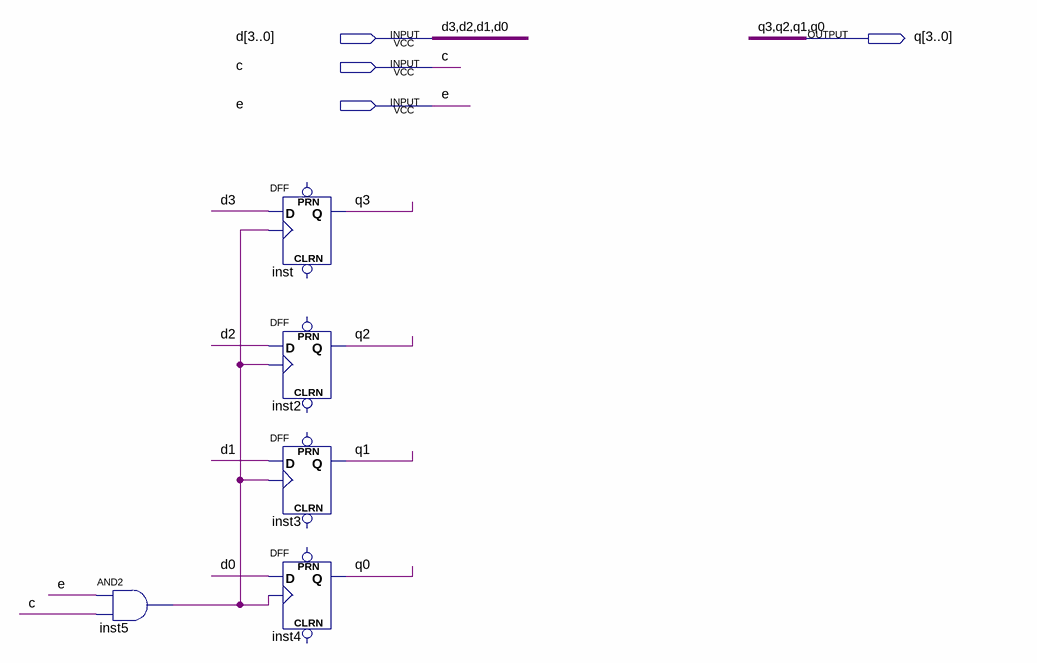
[diagram p0: schematic sheet]
// Quartus schematic s56_din_reg.bdf as structural Verilog: 5 symbols, 4 pins
module s56_din_reg (
  input  [3:0] d,
  input  c,
  input  e,
  output [3:0] q
);

  wire inst5_out;

  and inst5 (inst5_out, e, c);
  DFF inst (.CLK(inst5_out), .D(d[3]), .Q(q[3]));  // open: CLRN, PRN
  DFF inst2 (.CLK(inst5_out), .D(d[2]), .Q(q[2]));  // open: CLRN, PRN
  DFF inst3 (.CLK(inst5_out), .D(d[1]), .Q(q[1]));  // open: CLRN, PRN
  DFF inst4 (.CLK(inst5_out), .D(d[0]), .Q(q[0]));  // open: CLRN, PRN
endmodule
